# Altium schematic sheet CANbus.SchDoc: Main Flight Computer CAN Bus
size A3; Revision: 1A; SheetNumber: 2; SheetTotal: 7; Organization: Brickworks; Address1: Matthew Glazer; Address2: Design Engineer
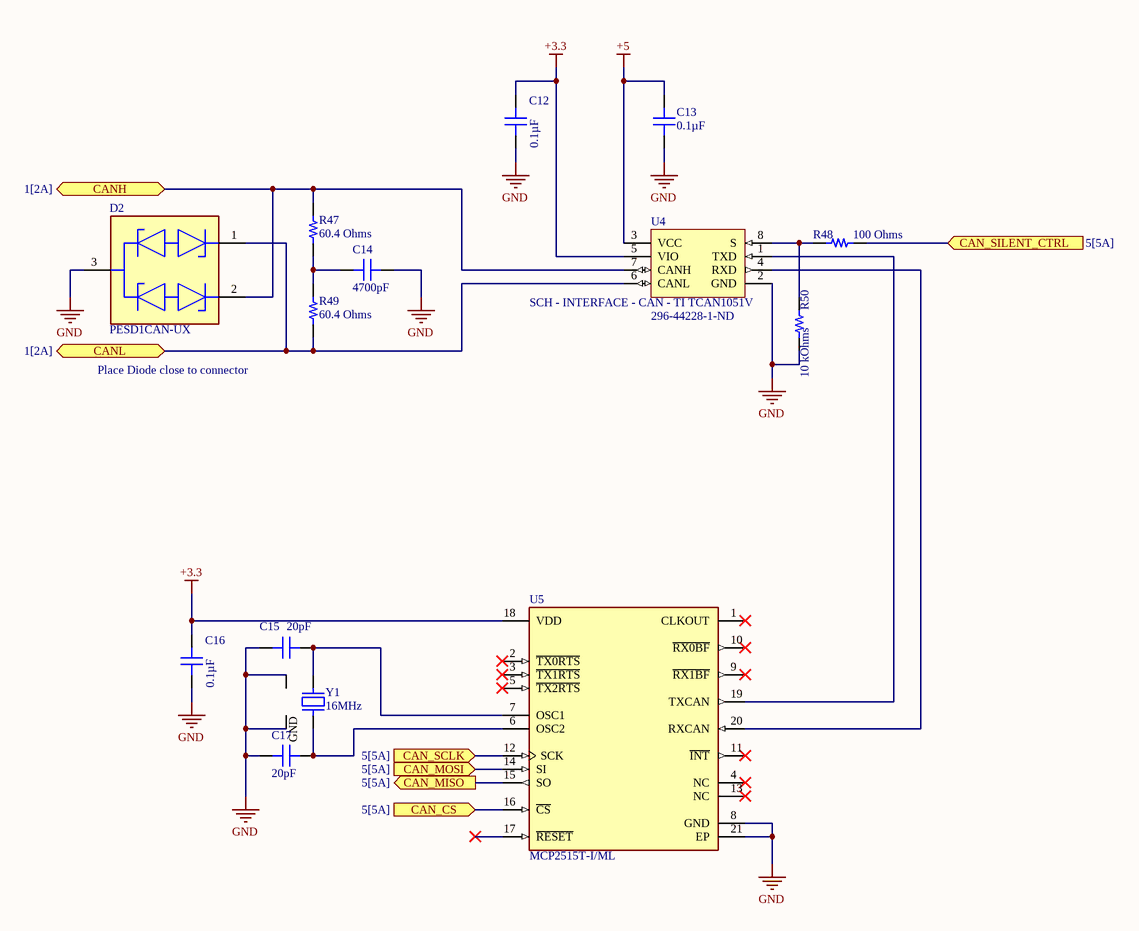
[diagram p0: CANbus.SchDoc]

## Parts
C12  0.1µF  [CAP 0603_1608]
C13  0.1µF  [CAP 0603_1608]
C14  4700pF  [CAP 0603_1608]
C15  20pF  [CAP 0603_1608]
C16  0.1µF  [CAP 0603_1608]
C17  20pF  [CAP 0603_1608]
D2  PESD1CAN-UX  [FP-SOT323-MFG]
R47  60.4 Ohms  [RES 1206_3216]
R48  100 Ohms  [RES 0603_1608]
R49  60.4 Ohms  [RES 1206_3216]
R50  10 kOhms  [RES 0603_1608]
U4  SCH - INTERFACE - CAN - TI TCAN1051V  Supplier Part Number 1: 296-44228-1-ND  [PCB - LEADS - SOIC - TI SOIC-8]
U5  MCP2515T-I/ML  [FP-C04-126-MFG]
Y1  16MHz  [EPSON TSX-3225]

## Ports
CAN_CS (in, see 5[5A]), CAN_MISO (out, see 5[5A]), CAN_MOSI (in, see 5[5A]), CAN_SCLK (in, see 5[5A]), CAN_SILENT_CTRL (in, see 5[5A]), CANH (bidir, see 1[2A]), CANL (bidir, see 1[2A])

## Nets
+3.3: C12.2 C16.2 U4.5(VIO) U5.18(VDD)
+5: C13.2 U4.3(VCC)
GND: C12.1 C13.1 C14.2 C15.1 C16.1 C17.1 D2.3(common_cathode) R50.1 U4.2(GND) U5.8(GND) U5.21(EP) Y1.2(GND) Y1.4(GND)
CAN_CS: U5.16(~{CS}) ; port CAN_CS
CAN_MISO: U5.15(SO) ; port CAN_MISO
CAN_MOSI: U5.14(SI) ; port CAN_MOSI
CAN_SCLK: U5.12(SCK) ; port CAN_SCLK
CAN_SILENT_CTRL: R48.2 ; port CAN_SILENT_CTRL
CANH: D2.2(cathode_2) R47.2 U4.7(CANH) ; port CANH
CANL: D2.1(cathode_1) R49.1 U4.6(CANL) ; port CANL
NetC14_1: C14.1 R47.1 R49.2
NetC15_2: C15.2 U5.7(OSC1) Y1.3
NetC17_2: C17.2 U5.6(OSC2) Y1.1
NetR48_1: R48.1 R50.2 U4.8(S)
NetU4_1: U4.1(TXD) U5.19(TXCAN)
NetU4_4: U4.4(RXD) U5.20(RXCAN)

Not connected (* = marked no-connect by the designer): U5 1(CLKOUT)* 2(~{TX0RTS})* 3(~{TX1RTS})* 4(NC)* 5(~{TX2RTS})* 9(~{RX1BF})* 10(~{RX0BF})* 11(~{INT})* 13(NC)* 17(~{RESET})*

## Notes on the sheet
- Place Diode close to connector
- Title
- Size:
- Date:
- A3
- Number:
- Time:
- Revision:
- Sheet
- of
- File:

## Library data of the parts
C12 C13 C16 = CL10B104KA8WPNC: CAP CER 0.1UF 25V X7R 0603; Manufacturer: Samsung Electro-Mechanics; Tolerance: ±10%; Part Number: CL10B104KA8WPNC; Value: 0.1µF; Applications: Automotive; Capacitance: 0.1µF; ComponentLink1Description: Datasheet; ComponentLink1URL: http://www.samsungsem.com/kr/support/product-search/mlcc/CL10B104KA8WPNC.jsp; ComponentLink2Description: DigiKey Link; ComponentLink2URL: http://digikey.com/product-detail/en/samsung-electro-mechanics/CL10B104KA8WPNC/1276-6717-1-ND/5961576; Device Package: 0603 (1608 Metric); Features: Open Mode; LastUpdated: 9/2/2020 1:03:30 AM; Lifecycle Status: Active; Minimum Order: 1; Mounting Type: Surface Mount, MLCC; Operating Temperature: -55°C ~ 125°C; Package / Case: 0603 (1608 Metric); Packaging: TapeAndReel; PartId: 5631; Part Status: Active; Price: 0.02; Ratings: AEC-Q200; Series: CL; Size / Dimension: 0.063" L x 0.031" W (1.60mm x 0.80mm); Supplier 1: DigiKey; Supplier Part Number 1: 1276-6717-1-ND; Temperature Coefficient: X7R; Thickness (Max): 0.035" (0.90mm); Voltage - Rated: 25V
C14 = VJ0603Y472KXACW1BC: CAP CER 4700PF 50V X7R 0603; Manufacturer: Vishay Vitramon; Tolerance: ±10%; Part Number: VJ0603Y472KXACW1BC; Value: 4700pF; Applications: General Purpose; Capacitance: 4700pF; ComponentLink1Description: Datasheet; ComponentLink1URL: https://www.vishay.com/docs/28548/vjw1bcbascomseries.pdf; ComponentLink2Description: DigiKey Link; ComponentLink2URL: http://digikey.com/product-detail/en/vishay-vitramon/VJ0603Y472KXACW1BC/720-1530-1-ND/421007; Device Package: 0603 (1608 Metric); LastUpdated: 9/2/2020 1:03:13 AM; Lifecycle Status: Active; Minimum Order: 1; Mounting Type: Surface Mount, MLCC; Operating Temperature: -55°C ~ 125°C; Package / Case: 0603 (1608 Metric); Packaging: TapeAndReel; PartId: 14247; Part Status: Active; Price: 0.01; Series: VJ; Size / Dimension: 0.063" L x 0.031" W (1.60mm x 0.80mm); Supplier 1: DigiKey; Supplier Part Number 1: 720-1530-1-ND; Temperature Coefficient: X7R; Thickness (Max): 0.035" (0.90mm); Voltage - Rated: 50V
C15 C17 = CML0603C0G200JT50V: CAP CER 20PF 50V C0G/NP0 0603; Manufacturer: Stackpole Electronics Inc; Temperature Coefficient: C0G, NP0; Tolerance: ±5%; Part Number: CML0603C0G200JT50V; Value: 20pF; Applications: General Purpose; Capacitance: 20pF; ComponentLink1Description: Datasheet; ComponentLink1URL: http://www.seielect.com/Catalog/SEI-CML.PDF; ComponentLink2Description: DigiKey Link; ComponentLink2URL: http://digikey.com/product-detail/en/stackpole-electronics-inc/CML0603C0G200JT50V/738-CML0603C0G200JT50VCT-ND/10660186; Device Package: 0603 (1608 Metric); LastUpdated: 9/2/2020 1:03:28 AM; Lifecycle Status: Active; Minimum Order: 1; Mounting Type: Surface Mount, MLCC; Operating Temperature: -55°C ~ 125°C; Package / Case: 0603 (1608 Metric); Packaging: Unknown; PartId: 26340; Part Status: Active; Price: 0.01; Series: CML_C0G; Supplier 1: DigiKey; Supplier Part Number 1: 738-CML0603C0G200JT50VCT-ND; Voltage - Rated: 50V
D2 = CMP-14436-000006-1: TVS DIODE 24V 50V SC70-3
R47 R49 = ESR18EZPF60R4: RES SMD 60.4 OHM 1% 1/2W 1206; Manufacturer: Rohm Semiconductor; Power (Watts): 0.5W, 1/2W; Temperature Coefficient: ±100ppm/°C; Part Number: ESR18EZPF60R4; ComponentLink1Description: Datasheet; ComponentLink1URL: https://www.rohm.com/datasheet/ESR01MZPF/esr-e; ComponentLink2Description: DigiKey Link; ComponentLink2URL: http://digikey.com/product-detail/en/rohm-semiconductor/ESR18EZPF60R4/RHM60.4AFCT-ND/1983938; Composition: Thick Film; Device Package: 1206 (3216 Metric); Features: Automotive AEC-Q200, Pulse Withstanding; Height - Seated (Max): 0.026" (0.65mm); LastUpdated: 9/2/2020 1:12:41 AM; Lifecycle Status: Active; Minimum Order: 1; Number of Terminations: 2; Operating Temperature: -55°C ~ 155°C; Package / Case: 1206 (3216 Metric); Packaging: TapeAndReel; PartId: 38901; Part Status: Active; Price: 0.02; Ratings: AEC-Q200; Resistance: 60.4 Ohms; Series: ESR; Size / Dimension: 0.126" L x 0.063" W (3.20mm x 1.60mm); Supplier 1: DigiKey; Supplier Part Number 1: RHM60.4AFCT-ND; Supplier Device Package: 1206; Tolerance: ±1%; Value: 60.4 Ohms
R48 = RMCF0603FG100R: RES 100 OHM 1% 1/10W 0603; Manufacturer: Stackpole Electronics Inc; Power (Watts): 0.1W, 1/10W; Temperature Coefficient: ±100ppm/°C; Part Number: RMCF0603FG100R; Value: 100 Ohms; ComponentLink1Description: Datasheet; ComponentLink1URL: https://www.seielect.com/catalog/sei-rmcf_rmcp.pdf; ComponentLink2Description: DigiKey Link; ComponentLink2URL: http://digikey.com/product-detail/en/stackpole-electronics-inc/RMCF0603FG100R/RMCF0603FG100RCT-ND/4425033; Composition: Thick Film; Device Package: 0603 (1608 Metric); Features: Automotive AEC-Q200; Height - Seated (Max): 0.022" (0.55mm); LastUpdated: 9/2/2020 1:09:39 AM; Lifecycle Status: Active; Minimum Order: 1; Number of Terminations: 2; Operating Temperature: -55°C ~ 155°C; Package / Case: 0603 (1608 Metric); Packaging: CutTape; PartId: 24036; Part Status: Active; Price: 0.10; Ratings: AEC-Q200; Resistance: 100 Ohms; Series: RMCF; Size / Dimension: 0.061" L x 0.031" W (1.55mm x 0.80mm); Supplier 1: DigiKey; Supplier Part Number 1: RMCF0603FG100RCT-ND; Supplier Device Package: 0603; Tolerance: ±1%
R50 = RMCF0603JT10K0: RES 10K OHM 5% 1/10W 0603; Manufacturer: Stackpole Electronics Inc; Power (Watts): 0.1W, 1/10W; Temperature Coefficient: ±200ppm/°C; Part Number: RMCF0603JT10K0; Value: 10 kOhms; ComponentLink1Description: Datasheet; ComponentLink1URL: https://www.seielect.com/catalog/sei-packaging.pdf; ComponentLink2Description: DigiKey Link; ComponentLink2URL: http://digikey.com/product-detail/en/stackpole-electronics-inc/RMCF0603JT10K0/RMCF0603JT10K0CT-ND/1943191; Composition: Thick Film; Device Package: 0603 (1608 Metric); Features: Automotive AEC-Q200; Height - Seated (Max): 0.022" (0.55mm); LastUpdated: 9/2/2020 1:09:31 AM; Lifecycle Status: Active; Minimum Order: 1; Number of Terminations: 2; Operating Temperature: -55°C ~ 155°C; Package / Case: 0603 (1608 Metric); Packaging: CutTape; PartId: 25659; Part Status: Active; Price: 0.10; Ratings: AEC-Q200; Resistance: 10 kOhms; Series: RMCF; Size / Dimension: 0.061" L x 0.031" W (1.55mm x 0.80mm); Supplier 1: DigiKey; Supplier Part Number 1: RMCF0603JT10K0CT-ND; Supplier Device Package: 0603; Tolerance: ±5%
U5 = CMP-0186-00186-2: IC CAN CTLR W/SPI 2.0B 20-QFN; Max Supply Voltage: 5.5V; Max Supply Current: 10mA; Number of Transceivers: 1; Min Supply Voltage: 2.7V; Data Rate: 1000Kbps; Interface: SPI; Mount: Surface Mount; Packaging: Tape and Reel; Lead Free: Lead Free; Package Quantity: 3300; Case/Package: QFN; Max Operating Temperature: 85°C; Number of Pins: 20; Min Operating Temperature: -40°C; Contact Plating: Tin; Radiation Hardening: No; Nominal Supply Current: 10mA
Y1 = TSX-3225 16.0000MF10U-B0: CRYSTAL 16.00 MHZ 16.0PF SMD; Manufacturer: EPSON; ESR (Equivalent Series Resistance): 60 Ohms; Frequency Stability: ±10ppm; Load Capacitance: 16pF; Operating Mode: Fundamental; Part Number: TSX-3225 16.0000MF10U-B0; ComponentLink1Description: Datasheet; ComponentLink1URL: https://support.epson.biz/td/api/doc_check.php?dl=brief_TSX-3225&lang=en; ComponentLink2Description: DigiKey Link; ComponentLink2URL: http://digikey.com/product-detail/en/epson/TSX-3225-16.0000MF10U-B0/SER4370CT-ND/7932354; Frequency: 16MHz; Frequency Tolerance: ±10ppm; Height - Seated (Max): 0.024" (0.60mm); LastUpdated: 9/2/2020 1:21:55 AM; Lifecycle Status: Active; Minimum Order: 1; Mounting Type: Surface Mount; Operating Temperature: -10°C ~ 60°C; Package / Case: 4-SMD, No Lead; Packaging: TapeAndReel; PartId: 436; Part Status: Active; Price: 0.18; Series: TSX-3225; Size / Dimension: 0.126" L x 0.098" W (3.20mm x 2.50mm); Supplier 1: DigiKey; Supplier Part Number 1: SER4370CT-ND; Type: MHz Crystal; Value: 16MHz
U4 = SCH - INTERFACE - CAN - TI TCAN1051V: Supplier 1: Digi-Key